# Altium schematic sheet BRD_EPM240.SchDoc
size A3; Address1: Address1; Address2: Address2; Address3: Address3; Address4: Address4; DocumentNumber: CPAE 525.1 XXX YY E3; SheetNumber: 1; Scale: 1:1; FirstReferrence: CPAE 525.1 XXX YY; Grupa: E-101; Format: A2
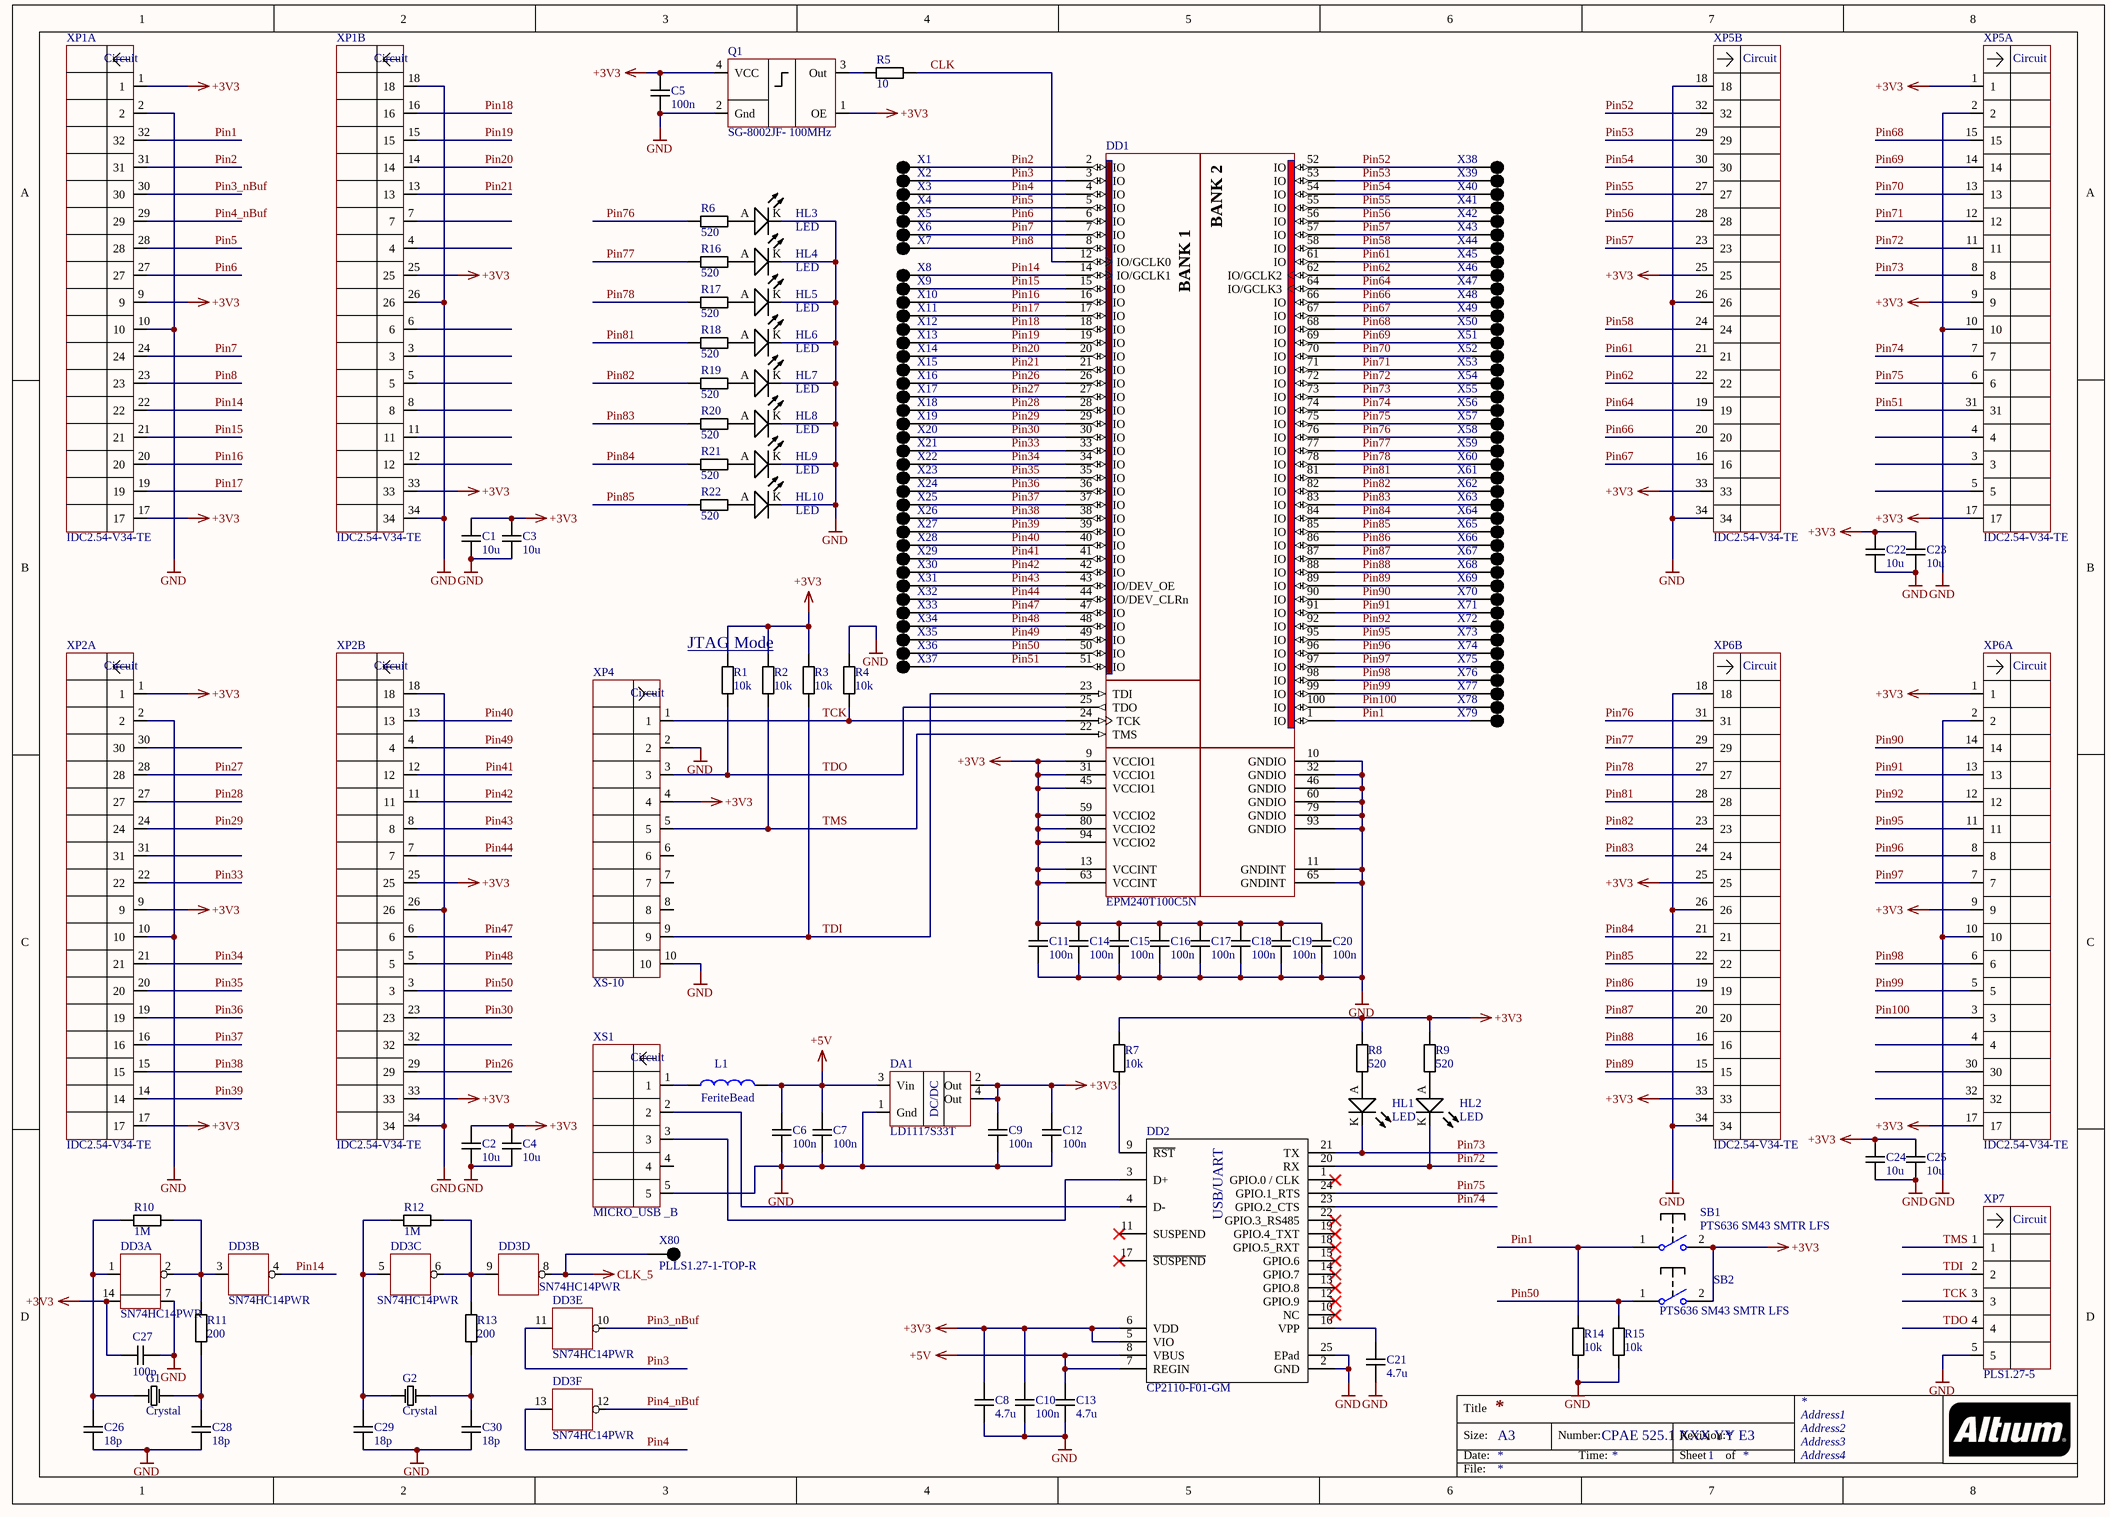
[diagram p0: BRD_EPM240.SchDoc]

## Parts
C1  10u  [CAPC1608(0603)N]
C2  10u  [CAPC1608(0603)N]
C3  10u  [CAPC1608(0603)N]
C4  10u  [CAPC1608(0603)N]
C5  100n  [CAPC1608(0603)N]
C6  100n  [CAPC1608(0603)N]
C7  100n  [CAPC1608(0603)N]
C8  4.7u  [CAPC1608(0603)N]
C9  100n  [CAPC1608(0603)N]
C10  100n  [CAPC1608(0603)N]
C11  100n  [CAPC1608(0603)N]
C12  100n  [CAPC1608(0603)N]
C13  4.7u  [CAPC1608(0603)N]
C14  100n  [CAPC1608(0603)N]
C15  100n  [CAPC1608(0603)N]
C16  100n  [CAPC1608(0603)N]
C17  100n  [CAPC1608(0603)N]
C18  100n  [CAPC1608(0603)N]
C19  100n  [CAPC1608(0603)N]
C20  100n  [CAPC1608(0603)N]
C21  4.7u  [CAPC1608(0603)N]
C22  10u  [CAPC1608(0603)N]
C23  10u  [CAPC1608(0603)N]
C24  10u  [CAPC1608(0603)N]
C25  10u  [CAPC1608(0603)N]
C26  18p  [CAPC1608(0603)N]
C27  100p  [CAPC1608(0603)N]
C28  18p  [CAPC1608(0603)N]
C29  18p  [CAPC1608(0603)N]
C30  18p  [CAPC1608(0603)N]
DA1  LD1117S33T  [SOT223_M]
DD1  EPM240T100C5N  [TQFP100_M]
DD2  CP2110-F01-GM  [QFN24_N]
DD3  SN74HC14PWR  [TSSOP14]  (parts A,B,C,D,E,F of 6)
G1  Crystal  [HC-49/S]
G2  Crystal  [HC-49/S]
HL1  LED  [LED-0603-BLUE]
HL2  LED  [LED-0603-GREEN]
HL3  LED  [LED-0603-GREEN]
HL4  LED  [LED-0603-GREEN]
HL5  LED  [LED-0603-GREEN]
HL6  LED  [LED-0603-GREEN]
HL7  LED  [LED-0603-GREEN]
HL8  LED  [LED-0603-GREEN]
HL9  LED  [LED-0603-GREEN]
HL10  LED  [LED-0603-GREEN]
L1  FeriteBead  [INDC1608(0603)N]
Q1  SG-8002JF- 100MHz  [SG-8002JF]
R1  10k  [RESC1608(0603)N]
R2  10k  [RESC1608(0603)N]
R3  10k  [RESC1608(0603)N]
R4  10k  [RESC1608(0603)N]
R5  10  [RESC1608(0603)N]
R6  520  [RESC1608(0603)N]
R7  10k  [RESC1608(0603)N]
R8  520  [RESC1608(0603)N]
R9  520  [RESC1608(0603)N]
R10  1M  [RESC1608(0603)N]
R11  200  [RESC1608(0603)N]
R12  1M  [RESC1608(0603)N]
R13  200  [RESC1608(0603)N]
R14  10k  [RESC1608(0603)N]
R15  10k  [RESC1608(0603)N]
R16  520  [RESC1608(0603)N]
R17  520  [RESC1608(0603)N]
R18  520  [RESC1608(0603)N]
R19  520  [RESC1608(0603)N]
R20  520  [RESC1608(0603)N]
R21  520  [RESC1608(0603)N]
R22  520  [RESC1608(0603)N]
SB1  PTS636 SM43 SMTR LFS  [PTS636 SM43 SMTR LFS]
SB2  PTS636 SM43 SMTR LFS  [PTS636 SM43 SMTR LFS]
X1  X1-PLLD1.27-1  [PLLS1.27-1]  (value not drawn)
X2  X1-PLLD1.27-1  [PLLS1.27-1]  (value not drawn)
X3  X1-PLLD1.27-1  [PLLS1.27-1]  (value not drawn)
X4  X1-PLLD1.27-1  [PLLS1.27-1]  (value not drawn)
X5  X1-PLLD1.27-1  [PLLS1.27-1]  (value not drawn)
X6  X1-PLLD1.27-1  [PLLS1.27-1]  (value not drawn)
X7  X1-PLLD1.27-1  [PLLS1.27-1]  (value not drawn)
X8  X1-PLLD1.27-1  [PLLS1.27-1]  (value not drawn)
X9  X1-PLLD1.27-1  [PLLS1.27-1]  (value not drawn)
X10  X1-PLLD1.27-1  [PLLS1.27-1]  (value not drawn)
X11  X1-PLLD1.27-1  [PLLS1.27-1]  (value not drawn)
X12  X1-PLLD1.27-1  [PLLS1.27-1]  (value not drawn)
X13  X1-PLLD1.27-1  [PLLS1.27-1]  (value not drawn)
X14  X1-PLLD1.27-1  [PLLS1.27-1]  (value not drawn)
X15  X1-PLLD1.27-1  [PLLS1.27-1]  (value not drawn)
X16  X1-PLLD1.27-1  [PLLS1.27-1]  (value not drawn)
X17  X1-PLLD1.27-1  [PLLS1.27-1]  (value not drawn)
X18  X1-PLLD1.27-1  [PLLS1.27-1]  (value not drawn)
X19  X1-PLLD1.27-1  [PLLS1.27-1]  (value not drawn)
X20  X1-PLLD1.27-1  [PLLS1.27-1]  (value not drawn)
X21  X1-PLLD1.27-1  [PLLS1.27-1]  (value not drawn)
X22  X1-PLLD1.27-1  [PLLS1.27-1]  (value not drawn)
X23  X1-PLLD1.27-1  [PLLS1.27-1]  (value not drawn)
X24  X1-PLLD1.27-1  [PLLS1.27-1]  (value not drawn)
X25  X1-PLLD1.27-1  [PLLS1.27-1]  (value not drawn)
X26  X1-PLLD1.27-1  [PLLS1.27-1]  (value not drawn)
X27  X1-PLLD1.27-1  [PLLS1.27-1]  (value not drawn)
X28  X1-PLLD1.27-1  [PLLS1.27-1]  (value not drawn)
X29  X1-PLLD1.27-1  [PLLS1.27-1]  (value not drawn)
X30  X1-PLLD1.27-1  [PLLS1.27-1]  (value not drawn)
X31  X1-PLLD1.27-1  [PLLS1.27-1]  (value not drawn)
X32  X1-PLLD1.27-1  [PLLS1.27-1]  (value not drawn)
X33  X1-PLLD1.27-1  [PLLS1.27-1]  (value not drawn)
X34  X1-PLLD1.27-1  [PLLS1.27-1]  (value not drawn)
X35  X1-PLLD1.27-1  [PLLS1.27-1]  (value not drawn)
X36  X1-PLLD1.27-1  [PLLS1.27-1]  (value not drawn)
X37  X1-PLLD1.27-1  [PLLS1.27-1]  (value not drawn)
X38  X1-PLLD1.27-1  [PLLS1.27-1]  (value not drawn)
X39  X1-PLLD1.27-1  [PLLS1.27-1]  (value not drawn)
X40  X1-PLLD1.27-1  [PLLS1.27-1]  (value not drawn)
X41  X1-PLLD1.27-1  [PLLS1.27-1]  (value not drawn)
X42  X1-PLLD1.27-1  [PLLS1.27-1]  (value not drawn)
X43  X1-PLLD1.27-1  [PLLS1.27-1]  (value not drawn)
X44  X1-PLLD1.27-1  [PLLS1.27-1]  (value not drawn)
X45  X1-PLLD1.27-1  [PLLS1.27-1]  (value not drawn)
X46  X1-PLLD1.27-1  [PLLS1.27-1]  (value not drawn)
X47  X1-PLLD1.27-1  [PLLS1.27-1]  (value not drawn)
X48  X1-PLLD1.27-1  [PLLS1.27-1]  (value not drawn)
X49  X1-PLLD1.27-1  [PLLS1.27-1]  (value not drawn)
X50  X1-PLLD1.27-1  [PLLS1.27-1]  (value not drawn)
X51  X1-PLLD1.27-1  [PLLS1.27-1]  (value not drawn)
X52  X1-PLLD1.27-1  [PLLS1.27-1]  (value not drawn)
X53  X1-PLLD1.27-1  [PLLS1.27-1]  (value not drawn)
X54  X1-PLLD1.27-1  [PLLS1.27-1]  (value not drawn)
X55  X1-PLLD1.27-1  [PLLS1.27-1]  (value not drawn)
X56  X1-PLLD1.27-1  [PLLS1.27-1]  (value not drawn)
X57  X1-PLLD1.27-1  [PLLS1.27-1]  (value not drawn)
X58  X1-PLLD1.27-1  [PLLS1.27-1]  (value not drawn)
X59  X1-PLLD1.27-1  [PLLS1.27-1]  (value not drawn)
X60  X1-PLLD1.27-1  [PLLS1.27-1]  (value not drawn)
X61  X1-PLLD1.27-1  [PLLS1.27-1]  (value not drawn)
X62  X1-PLLD1.27-1  [PLLS1.27-1]  (value not drawn)
X63  X1-PLLD1.27-1  [PLLS1.27-1]  (value not drawn)
X64  X1-PLLD1.27-1  [PLLS1.27-1]  (value not drawn)
X65  X1-PLLD1.27-1  [PLLS1.27-1]  (value not drawn)
X66  X1-PLLD1.27-1  [PLLS1.27-1]  (value not drawn)
X67  X1-PLLD1.27-1  [PLLS1.27-1]  (value not drawn)
X68  X1-PLLD1.27-1  [PLLS1.27-1]  (value not drawn)
X69  X1-PLLD1.27-1  [PLLS1.27-1]  (value not drawn)
X70  X1-PLLD1.27-1  [PLLS1.27-1]  (value not drawn)
X71  X1-PLLD1.27-1  [PLLS1.27-1]  (value not drawn)
X72  X1-PLLD1.27-1  [PLLS1.27-1]  (value not drawn)
X73  X1-PLLD1.27-1  [PLLS1.27-1]  (value not drawn)
X74  X1-PLLD1.27-1  [PLLS1.27-1]  (value not drawn)
X75  X1-PLLD1.27-1  [PLLS1.27-1]  (value not drawn)
X76  X1-PLLD1.27-1  [PLLS1.27-1]  (value not drawn)
X77  X1-PLLD1.27-1  [PLLS1.27-1]  (value not drawn)
X78  X1-PLLD1.27-1  [PLLS1.27-1]  (value not drawn)
X79  X1-PLLD1.27-1  [PLLS1.27-1]  (value not drawn)
X80  PLLS1.27-1-TOP-R  [PLLS1.27-1-TOP-R]
XP1  IDC2.54-V34-TE  [IDC2.54-V34-TE]  (parts A,B of 2)
XP2  IDC2.54-V34-TE  [IDC2.54-V34-TE]  (parts A,B of 2)
XP4  XS-10  [BH-10]
XP5  IDC2.54-V34-TE  [IDC2.54-V34-TE]  (parts A,B of 2)
XP6  IDC2.54-V34-TE  [IDC2.54-V34-TE]  (parts A,B of 2)
XP7  PLS1.27-5  [PLLS1.27-5]
XS1  MICRO_USB _B  [MICRO_USB _B]

## Nets
+3V3: C1.2 C2.2 C3.2 C4.2 C5.2 C8.2 C9.2 C10.2 C11.2 C12.2 C14.2 C15.2 C16.2 C17.2 C18.2 C19.2 C20.2 C22.2 C23.2 C24.2 C25.2 C27.1 DA1.2(Out) DA1.4(Out) DD1.9(VCCIO1) DD1.13(VCCINT) DD1.31(VCCIO1) DD1.45(VCCIO1) DD1.59(VCCIO2) DD1.63(VCCINT) DD1.80(VCCIO2) DD1.94(VCCIO2) DD2.5(VIO) DD2.6(VDD) DD3.14(VCC) Q1.1(OE) Q1.4(VCC) R1.2 R2.2 R3.2 R7.1 R8.2 R9.2 SB1.2(NO) SB2.2(NO) XP1.1 XP1.9 XP1.17 XP1.25 XP1.33 XP2.1 XP2.9 XP2.17 XP2.25 XP2.33 XP4.4 XP5.1 XP5.9 XP5.17 XP5.25 XP5.33 XP6.1 XP6.9 XP6.17 XP6.25 XP6.33
+5V: C6.2 C7.2 C13.2 DA1.3(Vin) DD2.7(REGIN) DD2.8(VBUS) L1.2
CLK_5: DD3.8(4Y) X80.1
GND: C1.1 C2.1 C3.1 C4.1 C5.1 C6.1 C7.1 C8.1 C9.1 C10.1 C11.1 C12.1 C13.1 C14.1 C15.1 C16.1 C17.1 C18.1 C19.1 C20.1 C21.1 C22.1 C23.1 C24.1 C25.1 C26.1 C27.2 C28.1 C29.1 C30.1 DA1.1(Gnd) DD1.10(GNDIO) DD1.11(GNDINT) DD1.32(GNDIO) DD1.46(GNDIO) DD1.60(GNDIO) DD1.65(GNDINT) DD1.79(GNDIO) DD1.93(GNDIO) DD2.2(GND) DD2.25(EPad) DD3.7(GND) HL3.K HL4.K HL5.K HL6.K HL7.K HL8.K HL9.K HL10.K Q1.2(Gnd) R4.2 R14.2 R15.2 XP1.2 XP1.10 XP1.18 XP1.26 XP1.34 XP2.2 XP2.10 XP2.18 XP2.26 XP2.34 XP4.2 XP4.10 XP5.2 XP5.10 XP5.18 XP5.26 XP5.34 XP6.2 XP6.10 XP6.18 XP6.26 XP6.34 XP7.5 XS1.5
CLK: DD1.12(IO/GCLK0) R5.2
Pin1: DD1.1(IO) R14.1 SB1.1(COMMON) X79.1 XP1.32
Pin2: DD1.2(IO) X1.1 XP1.31
Pin3: DD1.3(IO) DD3.11(5A) X2.1
Pin3_nBuf: DD3.10(5Y) XP1.30
Pin4: DD1.4(IO) DD3.13(6A) X3.1
Pin4_nBuf: DD3.12(6Y) XP1.29
Pin5: DD1.5(IO) X4.1 XP1.28
Pin6: DD1.6(IO) X5.1 XP1.27
Pin7: DD1.7(IO) X6.1 XP1.24
Pin8: DD1.8(IO) X7.1 XP1.23
Pin14: DD1.14(IO/GCLK1) DD3.4(2Y) X8.1 XP1.22
Pin15: DD1.15(IO) X9.1 XP1.21
Pin16: DD1.16(IO) X10.1 XP1.20
Pin17: DD1.17(IO) X11.1 XP1.19
Pin18: DD1.18(IO) X12.1 XP1.16
Pin19: DD1.19(IO) X13.1 XP1.15
Pin20: DD1.20(IO) X14.1 XP1.14
Pin21: DD1.21(IO) X15.1 XP1.13
Pin26: DD1.26(IO) X16.1 XP2.29
Pin27: DD1.27(IO) X17.1 XP2.28
Pin28: DD1.28(IO) X18.1 XP2.27
Pin29: DD1.29(IO) X19.1 XP2.24
Pin30: DD1.30(IO) X20.1 XP2.23
Pin33: DD1.33(IO) X21.1 XP2.22
Pin34: DD1.34(IO) X22.1 XP2.21
Pin35: DD1.35(IO) X23.1 XP2.20
Pin36: DD1.36(IO) X24.1 XP2.19
Pin37: DD1.37(IO) X25.1 XP2.16
Pin38: DD1.38(IO) X26.1 XP2.15
Pin39: DD1.39(IO) X27.1 XP2.14
Pin40: DD1.40(IO) X28.1 XP2.13
Pin41: DD1.41(IO) X29.1 XP2.12
Pin42: DD1.42(IO) X30.1 XP2.11
Pin43: DD1.43(IO/DEV_OE) X31.1 XP2.8
Pin44: DD1.44(IO/DEV_CLRn) X32.1 XP2.7
Pin47: DD1.47(IO) X33.1 XP2.6
Pin48: DD1.48(IO) X34.1 XP2.5
Pin49: DD1.49(IO) X35.1 XP2.4
Pin50: DD1.50(IO) R15.1 SB2.1(COMMON) X36.1 XP2.3
Pin51: DD1.51(IO) X37.1 XP5.31
Pin52: DD1.52(IO) X38.1 XP5.32
Pin53: DD1.53(IO) X39.1 XP5.29
Pin54: DD1.54(IO) X40.1 XP5.30
Pin55: DD1.55(IO) X41.1 XP5.27
Pin56: DD1.56(IO) X42.1 XP5.28
Pin57: DD1.57(IO) X43.1 XP5.23
Pin58: DD1.58(IO) X44.1 XP5.24
Pin61: DD1.61(IO) X45.1 XP5.21
Pin62: DD1.62(IO/GCLK2) X46.1 XP5.22
Pin64: DD1.64(IO/GCLK3) X47.1 XP5.19
Pin66: DD1.66(IO) X48.1 XP5.20
Pin67: DD1.67(IO) X49.1 XP5.16
Pin68: DD1.68(IO) X50.1 XP5.15
Pin69: DD1.69(IO) X51.1 XP5.14
Pin70: DD1.70(IO) X52.1 XP5.13
Pin71: DD1.71(IO) X53.1 XP5.12
Pin72: DD1.72(IO) DD2.20(RX) HL2.K X54.1 XP5.11
Pin73: DD1.73(IO) DD2.21(TX) HL1.K X55.1 XP5.8
Pin74: DD1.74(IO) DD2.23(GPIO.2_CTS) X56.1 XP5.7
Pin75: DD1.75(IO) DD2.24(GPIO.1_RTS) X57.1 XP5.6
Pin76: DD1.76(IO) R6.2 X58.1 XP6.31
Pin77: DD1.77(IO) R16.2 X59.1 XP6.29
Pin78: DD1.78(IO) R17.2 X60.1 XP6.27
Pin81: DD1.81(IO) R18.2 X61.1 XP6.28
Pin82: DD1.82(IO) R19.2 X62.1 XP6.23
Pin83: DD1.83(IO) R20.2 X63.1 XP6.24
Pin84: DD1.84(IO) R21.2 X64.1 XP6.21
Pin85: DD1.85(IO) R22.2 X65.1 XP6.22
Pin86: DD1.86(IO) X66.1 XP6.19
Pin87: DD1.87(IO) X67.1 XP6.20
Pin88: DD1.88(IO) X68.1 XP6.16
Pin89: DD1.89(IO) X69.1 XP6.15
Pin90: DD1.90(IO) X70.1 XP6.14
Pin91: DD1.91(IO) X71.1 XP6.13
Pin92: DD1.92(IO) X72.1 XP6.12
Pin95: DD1.95(IO) X73.1 XP6.11
Pin96: DD1.96(IO) X74.1 XP6.8
Pin97: DD1.97(IO) X75.1 XP6.7
Pin98: DD1.98(IO) X76.1 XP6.6
Pin99: DD1.99(IO) X77.1 XP6.5
Pin100: DD1.100(IO) X78.1 XP6.3
TCK: DD1.24(TCK) R4.1 XP4.1 XP7.3
TDI: DD1.23(TDI) R3.1 XP4.9 XP7.2
TDO: DD1.25(TDO) R1.1 XP4.3 XP7.4
TMS: DD1.22(TMS) R2.1 XP4.5 XP7.1
NetC21_2: C21.2 DD2.16(VPP)
NetC26_2: C26.2 DD3.1(1A) G1.1 R10.1
NetC28_2: C28.2 G1.2 R11.1
NetC29_2: C29.2 DD3.5(3A) G2.1 R12.1
NetC30_2: C30.2 G2.2 R13.1
NetDD2_3: DD2.3(D+) XS1.3
NetDD2_4: DD2.4(D-) XS1.2
NetDD2_9: DD2.9(~{RST}) R7.2
NetDD3_2: DD3.2(1Y) DD3.3(2A) R10.2 R11.2
NetDD3_6: DD3.6(3Y) DD3.9(4A) R12.2 R13.2
NetHL1_A: HL1.A R8.1
NetHL2_A: HL2.A R9.1
NetHL3_A: HL3.A R6.1
NetHL4_A: HL4.A R16.1
NetHL5_A: HL5.A R17.1
NetHL6_A: HL6.A R18.1
NetHL7_A: HL7.A R19.1
NetHL8_A: HL8.A R20.1
NetHL9_A: HL9.A R21.1
NetHL10_A: HL10.A R22.1
NetL1_1: L1.1 XS1.1
NetQ1_3: Q1.3(Out) R5.1

Not connected (* = marked no-connect by the designer): DD2 1(GPIO.0_/_CLK)* 10(NC)* 11(SUSPEND)* 12(GPIO.9)* 13(GPIO.8)* 14(GPIO.7)* 15(GPIO.6)* 17(~{SUSPEND})* 18(GPIO.5_RXT)* 19(GPIO.4_TXT)* 22(GPIO.3_RS485)*; XP1 3 4 5 6 7 8 11 12; XP2 30 31 32; XP4 6 7 8; XP5 3 4 5; XP6 4 30 32; XS1 4

## Notes on the sheet
- JTAG Mode
- Title
- Size:
- Date:
- A3
- Number:
- Time:
- Revision:
- Sheet
- of
- File:
- (in symbol 3220-10-0100-00) Circuit
- (in symbol CP2110-F01-GM) USB/UART
- (in symbol EPM240T100C5N) BANK 1; BANK 2
- (in symbol IDC2.54-V34-TE, part A) Circuit
- (in symbol IDC2.54-V34-TE, part B) Circuit
- (in symbol LD1117S33T) DC/DC
- (in symbol MICRO_USB _B) Circuit
- (in symbol PLS1.27-5) Circuit

## Library data of the parts
C1-C30 = CAPC1608(0603): ?; Part Number: CAPC1608(0603); HelpURL: ?; Digi-Key Part Number: ?; Price$: ?; Note: ?; Manufacturer Part Number: ?; Package: ?
DD1 = EPM240T100C5N: MAX II 3.3/2.5V CPLD, 80 IOs, 240 Logic Elements, 100-Pin Plastic TQFP, Commercial Temperature, Speed Grade 5, Pb-Free; Note: Each set of VCCIO pins can be connected to 3.3V, 2.5V, 1.8V, or 1.5V.; Note: All VCCINT pins must be connected to either 3.3V or 2.5V (but not a combination of both).; Published: 4-Mar-2005; LatestRevisionDate: 13-Apr-2006; LatestRevisionNote: IPC-7351 Footprint Added.; DatasheetVersion: ver1.8, Jul-2006; PackageVersion: ver15.1, May-2008; PackageReference: TQFP100; Publisher: Altium Limited; PackageDescription: 100-Pin Plastic Thin Quad Flat Pack (TQFP100) - Wire Bond; Supplier 1: Digi-Key; Supplier Part Number 1: 544-1964-ND; Supplier 2: Farnell; Supplier Part Number 2: 1662268; Supplier 3: Farnell; Supplier Part Number 3: 1453503; Code_JEDEC: MS-026-AED; ComponentLink1Description: Manufacturer Link; ComponentLink1URL: http://www.altera.com/products/devices/cpld/max2/mx2-index.jsp; ComponentLink2Description: Handbook; ComponentLink2URL: http://www.altera.com/literature/hb/max2/max2_mii5v1.pdf; ComponentLink3Description: Packaging Specification; ComponentLink3URL: http://www.altera.com/literature/ds/dspkg.pdf; Part Number: EPM240T100C5N; HelpURL: http://ru.mouser.com/ProductDetail/Altera-Corporation/EPM240T100C5N/?qs=jblrfmjbeiHmgaW5DQXOiw%3d%3d
DD2 = CP2110-F01-GM: USB Bridge, USB to UART USB 2.0 UART Interface 24-QFN (4x4); Part Number: CP2110-F01-GM; HelpURL: https://www.digikey.com/product-detail/en/silicon-labs/CP2110-F01-GM/336-2006-5-ND/2486180; Price$: 1,54; Digi-Key Part Number: 336-2006-5-ND; Manufacturer Part Number: CP2110-F01-GM; Package: 24-QFN (4x4)
DD3 = SN74HC14PWR: IC INVERTER SCHMITT 6CH 14TSSOP; Part Number: SN74HC14PWR; HelpURL: https://www.digikey.com/product-detail/en/texas-instruments/SN74HC14PWR/296-8234-1-ND/376675
G1 G2 = Crystal HC-49/S: Part Number: Crystal HC-49/S
HL1 HL4-HL8 = LED-0603-BLUE: LED BLUE DIFFUSED 0603 SMD; Manufacturer Part Number: 150060BS55040; Part Number: LED-0603-BLUE; HelpURL: https://www.digikey.com/products/en?keywords=732-12013-1-ND; Digi-Key Part Number: 732-12013-1-ND; Price$: ?; Note: ?; Package: 0603
HL2 HL3 HL9 HL10 = LED-0603-GREEN: LED GREEN DIFFUSED 0603 SMD; Manufacturer Part Number: 150060VS55040; Part Number: LED-0603-GREEN; HelpURL: https://www.digikey.com/products/en?keywords=732-12017-1-ND; Digi-Key Part Number: 732-12017-1-ND; Price$: ?; Note: ?; Package: ?
L1 = INDC1608(0603): Part Number: INDC1608(0603)
Q1 = SG-8002JF: Part Number: SG-8002JF
R1-R4 R7 R14 R15 = RESC1005(0402): Note: ???; Part Number: RESC1005(0402); HelpURL: ???; Digi-Key Part Number: ???; Price$: ???; Manufacturer Part Number: ???; Package: ???
R5 R6 R8-R13 R16-R22 = RESC1608(0603): Note: ???; Part Number: RESC1608(0603); HelpURL: ???; Digi-Key Part Number: ???; Price$: ???; Manufacturer Part Number: ???; Package: ???
SB1 SB2 = PTS636 SM43 SMTR LFS: Tactile Switches Tact 50mA 12VDC, 6.0x3.5, 4.3mm H, 180gf, G leads, No ground pin, Black Actuator; Part Number: PTS636 SM43 SMTR LFS; HelpURL: https://eu.mouser.com/ProductDetail/CK/PTS636-SM43-SMTR-LFS?qs=sGAEpiMZZMsgGjVA3toVBC4OPD95ORcgaeKhIDqe9Es%3D; Price$: 0.11; Manufacturer Part Number: PTS636 SM43 SMTR LFS; Package: 2pinSMD; Mouser Part Number: 611-PTS636SM43SMTRLF
XP4 = 3220-10-0100-00: Part Number: 3220-10-0100-00; Digi-Key Part Number: 1175-1627-ND; HelpURL: https://www.digikey.com/product-detail/en/cnc-tech/3220-10-0100-00/1175-1627-ND/3883661
XP7 = PLS1.27-5: CONN HEADER VERT 5POS 1.27MM; Manufacturer Part Number: M50-3530542; Part Number: PLS1.27-5; HelpURL: https://www.digikey.com/product-detail/en/harwin-inc/M50-3530542/952-3601-ND/7044016; Digi-Key Part Number: 952-3601-ND; Price$: 0.21
XS1 = MICRO_USB _B: Note: ???; Part Number: MICRO_USB _B; HelpURL: https://www.digikey.com/product-detail/en/amphenol-icc-fci/10118194-0001LF/609-4618-1-ND/2785382; Digi-Key Part Number: ???; Price$: ???; Manufacturer Part Number: ???; Package: ???
DA1 = LD1117S33T: Part Number: LD1117S33T; HelpURL: http://www.mouser.com/ds/2/389/CD00000544-310772.pdf
X1-X79 = X1-PLLD1.27-1: Part Number: X1-PLLD1.27-1
X80 = PLLS1.27-1-TOP-R: Part Number: PLLS1.27-1-TOP-R
XP1 XP2 XP5 XP6 = IDC2.54-V34-TE: Part Number: IDC2.54-V34-TE